# EAGLE schematic Remotuino-v2 (EAGLE 5.07)
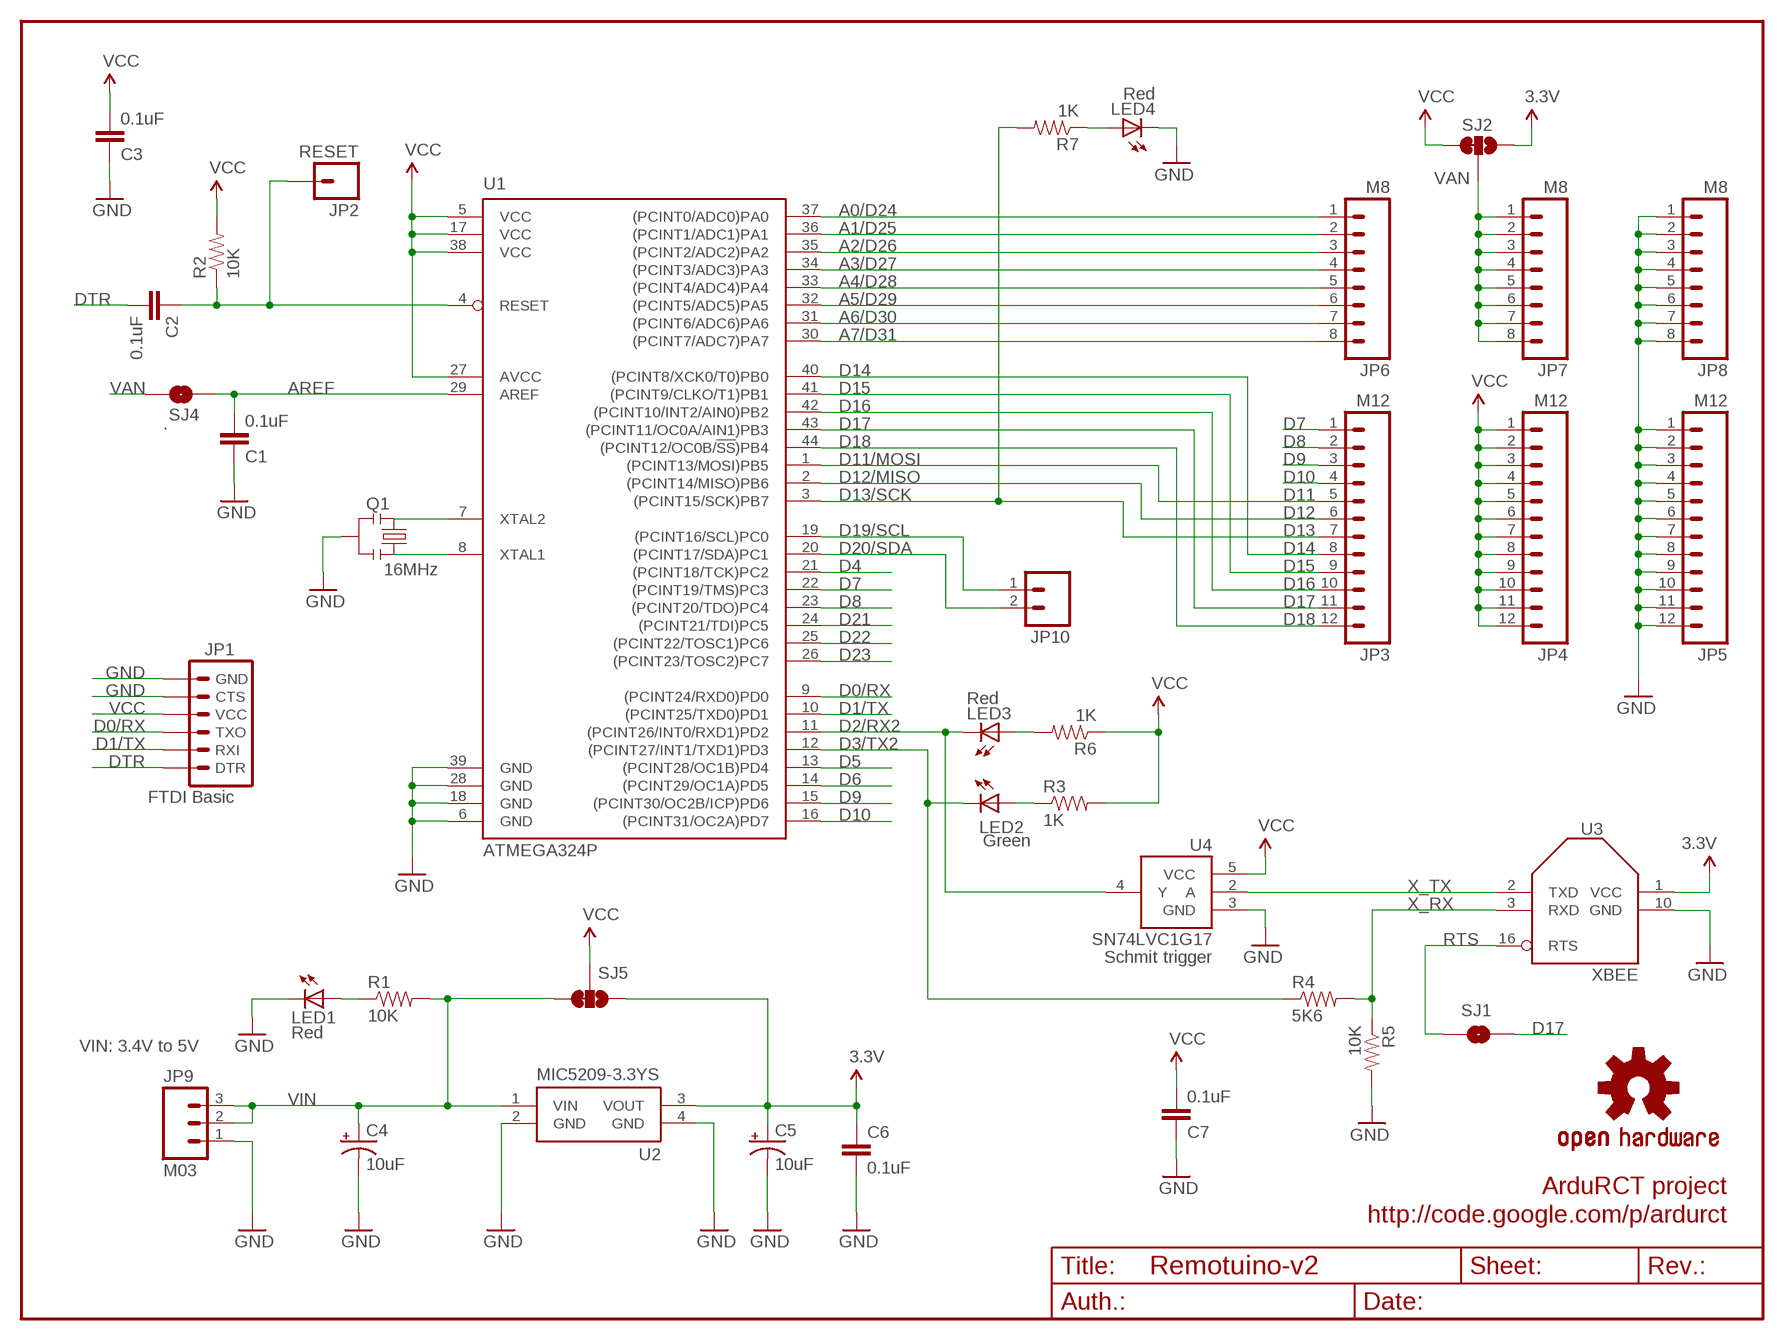
[diagram p0: schematic, sheet 1]

## Parts
C1  0.1uF  CAP0805  [0805]
C2  0.1uF  CAP0805  [0805]
C3  0.1uF  CAP0805  [0805]
C4  10uF  CAP_POL1206  [EIA3216]
C5  10uF  CAP_POL1206  [EIA3216]
C6  0.1uF  CAP0805  [0805]
C7  0.1uF  CAP0805  [0805]
JP1  FTDI Basic  ARDUINO_SERIAL_PROGRAMPTH  [1X06]
JP2  RESET  M01PTH  [1X01]
JP3  M12  M12PTH  [1X12]
JP4  M12  M12PTH  [1X12]
JP5  M12  M12PTH  [1X12]
JP6  M8  M08  [1X08]
JP7  M8  M08  [1X08]
JP8  M8  M08  [1X08]
JP9  M03  [1X3_LONGPAD]
JP10  M02  [1X02]
LED1  Red  LED805  [LED-0805]
LED2  Green  LED805  [LED-0805]
LED3  Red  LED805  [LED-0805]
LED4  Red  LED805  [LED-0805]
Q1  16MHz  RESONATORSMD  [RESONATOR-SMD]
R1  10K  RESISTOR0805-RES  [0805]
R2  10K  RESISTOR0805-RES  [0805]
R3  1K  RESISTOR0805-RES  [0805]
R4  5K6  RESISTOR0805-RES  [0805]
R5  10K  RESISTOR0805-RES  [0805]
R6  1K  RESISTOR0805-RES  [0805]
R7  1K  RESISTOR0805-RES  [0805]
SJ1  SOLDERJUMPERNO  [SJ_2S-NO]
SJ2  SJ_2WAYS_1-2W  [SJ_2WAYS_1-2]
SJ4  .  SOLDERJUMPERTRACE  [SJ_2S-TRACE]
SJ5  SJ_2WAYS_1-2W  [SJ_2WAYS_1-2]
U1  ATMEGA324P  ATMEGA324A  [TQFP44]
U2  MIC5209-3.3YS  MIC5209  [SOT223]
U3  XBEE  XBEE-SIMPLE  [XBEE-MIN]
U4  SN74LVC1G17  [SOT23-5]
U$2  OSHW-LOGOS  [OSHW-LOGO-S]

## Nets
3.3V: C5.A(+) C6.1 SJ2.3 SJ5.3 U2.3(VOUT) U3.1(VCC)
A0/D24: JP6.1 U1.37((PCINT0/ADC0)PA0)
A1/D25: JP6.2 U1.36((PCINT1/ADC1)PA1)
A2/D26: JP6.3 U1.35((PCINT2/ADC2)PA2)
A3/D27: JP6.4 U1.34((PCINT3/ADC3)PA3)
A4/D28: JP6.5 U1.33((PCINT4/ADC4)PA4)
A5/D29: JP6.6 U1.32((PCINT5/ADC5)PA5)
A6/D30: JP6.7 U1.31((PCINT6/ADC6)PA6)
A7/D31: JP6.8 U1.30((PCINT7/ADC7)PA7)
AREF: C1.2 SJ4.2 U1.29(AREF)
D0/RX: JP1.3(TXO) U1.9((PCINT24/RXD0)PD0)
D1/TX: JP1.2(RXI) U1.10((PCINT25/TXD0)PD1)
D2/RX2: LED3.2(C) U1.11((PCINT26/INT0/RXD1)PD2) U4.4(Y)
D3/TX2: LED2.2(C) R4.1 U1.12((PCINT27/INT1/TXD1)PD3)
D4: U1.21((PCINT18/TCK)PC2)
D5: U1.13((PCINT28/OC1B)PD4)
D6: U1.14((PCINT29/OC1A)PD5)
D7: JP3.1 U1.22((PCINT19/TMS)PC3)
D8: JP3.2 U1.23((PCINT20/TDO)PC4)
D9: JP3.3 U1.15((PCINT30/OC2B/ICP)PD6)
D10: JP3.4 U1.16((PCINT31/OC2A)PD7)
D11/MOSI: JP3.5 U1.1((PCINT13/MOSI)PB5)
D12/MISO: JP3.6 U1.2((PCINT14/MISO)PB6)
D13/SCK: JP3.7 R7.2 U1.3((PCINT15/SCK)PB7)
D14: JP3.8 U1.40((PCINT8/XCK0/T0)PB0)
D15: JP3.9 U1.41((PCINT9/CLKO/T1)PB1)
D16: JP3.10 U1.42((PCINT10/INT2/AIN0)PB2)
D17: JP3.11 SJ1.2 U1.43((PCINT11/OC0A/AIN1)PB3)
D18: JP3.12 U1.44((PCINT12/OC0B/!SS!)PB4)
D19/SCL: JP10.1 U1.19((PCINT16/SCL)PC0)
D20/SDA: JP10.2 U1.20((PCINT17/SDA)PC1)
D21: U1.24((PCINT21/TDI)PC5)
D22: U1.25((PCINT22/TOSC1)PC6)
D23: U1.26((PCINT23/TOSC2)PC7)
DTR: C2.2 JP1.1(DTR)
GND [vcc]: C1.1 C3.1 C4.C(-) C5.C(-) C6.2 C7.1 JP1.5(CTS) JP1.6(GND) JP5.1 JP5.2 JP5.3 JP5.4 JP5.5 JP5.6 JP5.7 JP5.8 JP5.9 JP5.10 JP5.11 JP5.12 JP8.1 JP8.2 JP8.3 JP8.4 JP8.5 JP8.6 JP8.7 JP8.8 JP9.1 LED1.2(C) LED4.2(C) Q1.2 R5.2 U1.6(GND) U1.18(GND) U1.28(GND) U1.39(GND) U2.2(GND) U2.4(GND) U3.10(GND) U4.3(GND)
N$1: Q1.1 U1.8(XTAL1)
N$2: Q1.3 U1.7(XTAL2)
N$3: LED2.1(A) R3.1
N$4: LED3.1(A) R6.2
N$5: LED4.1(A) R7.1
N$38: LED1.1(A) R1.1
RESET: C2.1 JP2.1 R2.1 U1.4(RESET)
RTS: SJ1.1 U3.16(RTS)
VAN: JP7.1 JP7.2 JP7.3 JP7.4 JP7.5 JP7.6 JP7.7 JP7.8 SJ2.2 SJ4.1
VCC [vcc]: C3.2 C7.2 JP1.4(VCC) JP4.1 JP4.2 JP4.3 JP4.4 JP4.5 JP4.6 JP4.7 JP4.8 JP4.9 JP4.10 JP4.11 JP4.12 R2.2 R3.2 R6.1 SJ2.1 SJ5.2 U1.5(VCC) U1.17(VCC) U1.27(AVCC) U1.38(VCC) U4.5(VCC)
VIN: C4.A(+) JP9.2 JP9.3 R1.2 SJ5.1 U2.1(VIN)
X_RX: R4.2 R5.1 U3.3(RXD)
X_TX: U3.2(TXD) U4.2(A)

## Notes on the sheet
- D11
- D12
- D13
- Schmit trigger
- VIN: 3.4V to 5V
- ArduRCT project
- http://code.google.com/p/ardurct

## Library data of the parts
C1-C3 C6 C7 = SparkFun:CAP: Capacitor Standard 0603 ceramic capacitor, and 0.1" leaded capacitor.
C4 C5 = SparkFun:CAP_POL: Capacitor Polarized These are standard SMD and PTH capacitors. Normally 10uF, 47uF, and 100uF in electrolytic and tantalum varieties. Always verify the external diameter of the through hole cap, it varies with capacity, voltage, and manufacturer. The EIA devices should be standard.
JP1 = SparkFun:ARDUINO_SERIAL_PROGRAM
JP2 = SparkFun:M01: Header 1 Standard 1-pin 0.1" header. Use with straight break away headers (SKU : PRT-00116), right angle break away headers (PRT-00553), swiss pins (PRT-00743), machine pins (PRT-00117), and female headers (PRT-00115).
JP3-JP5 = SparkFun:M12: Header 12 Standard 12-pin 0.1" header. Use with straight break away headers (SKU : PRT-00116), right angle break away headers (PRT-00553), swiss pins (PRT-00743), machine pins (PRT-00117), and female headers (PRT-00115).
JP6-JP8 = wibauxl:M08
JP9 = wibauxl:M03
JP10 = wibauxl:M02
LED1-LED4 = wibauxl:LED
Q1 = SparkFun:RESONATOR: Resonator Small SMD resonator. This is the itty bitty 10/20MHz resonators with built in caps. CSTCE10M0G55 and CSTCE20M0V53. Footprint has been reviewed closely but hasn't been tested yet.
R1-R7 = SparkFun:RESISTOR: Resistor Basic schematic elements and footprints for 0603, 1206, and PTH resistors.
SJ1 SJ4 = SparkFun:SOLDERJUMPER: Solder Jumper Standard SMD solder jumper. Used to automate production. Two varients : Normally Open and Normally Closed are the same, but have different paste layers. NC will have a large amount of paste and should jumper during reflow.
SJ2 SJ5 = wibauxl:SJ_2WAYS_1-2
U1 = wibauxl:ATMEGA324: 8-bit Microcontroller with 64K Bytes In-System Programmable Flash Source: http://www.atmel.com/dyn/resources/prod_documents/doc2593.pdf
U2 = wibauxl:MIC5209
U3 = wibauxl:XBEE-SIMPLE
U4 = wibauxl:SN74LVC1G17
U$2 = SparkFun:OSHW-LOGO: Open Source Hardware Logo This logo indicates the piece of hardware it is found on incorporates a OSHW license and/or adheres to the definition of open source hardware found here: http://freedomdefined.org/OSHW

## Net classes
0 default: width 0.203 mm
1 vcc: width 0.254 mm